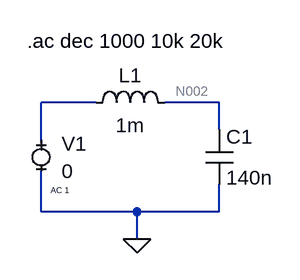
[diagram p0: schematic Draft5.asc]
Draft5.asc, the LTspice schematic file:
Version 4
SHEET 1 880 680
WIRE 144 96 80 96
WIRE 288 96 224 96
WIRE 288 128 288 96
WIRE 80 144 80 96
WIRE 80 224 80 176
WIRE 192 224 80 224
WIRE 288 224 288 192
WIRE 288 224 192 224
WIRE 192 256 192 224
FLAG 192 256 0
SYMBOL MiniSyms4\\voltage- 80 160 R0
WINDOW 123 11 39 Left 0
WINDOW 39 0 0 Left 0
SYMATTR InstName V1
SYMATTR Value 0
SYMATTR Value2 AC 1
SYMBOL ind 128 112 R270
WINDOW 0 32 56 VTop 2
WINDOW 3 5 56 VBottom 2
SYMATTR InstName L1
SYMATTR Value 1m
SYMBOL cap 272 128 R0
SYMATTR InstName C1
SYMATTR Value 140n
TEXT 64 24 Left 2 !.ac dec 1000 10k 20k

The netlist it stands for:
* Draft5.asc
V1 N001 0 0 AC 1
L1 N001 N002 1m
C1 N002 0 140n
.ac dec 1000 10k 20k
.backanno
.end

* Results of the author's LTspice run, read from the files saved beside the schematic
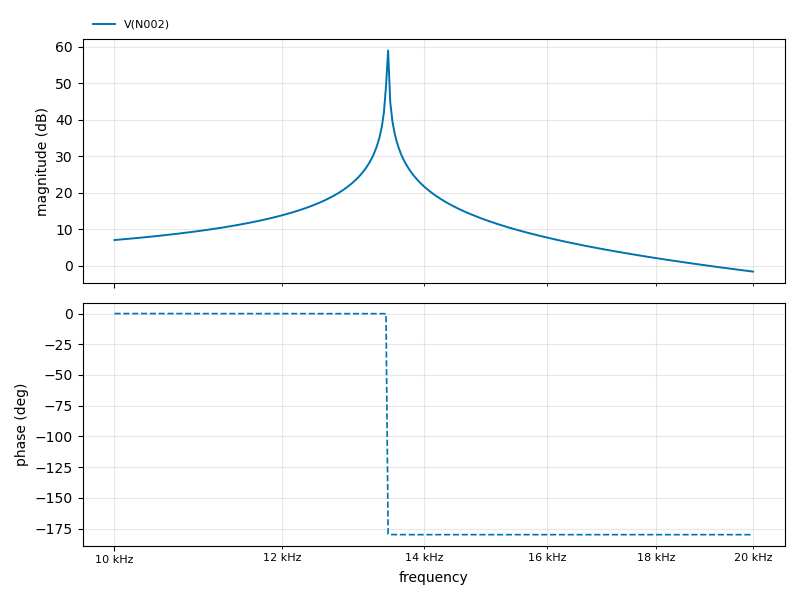
[diagram p1: AC Analysis of Draft5.asc, plotted from the saved traces]
* AC Analysis, 1 run:
*   V(N002): 6.99 dB at 10 kHz, -1.66 dB at 20 kHz, peak 58.99 dB at 13.46 kHz, 3 dB below the peak at 13.45 kHz and 13.47 kHz